# Altium schematic sheet Main_MCU_ATSAME54.SchDoc
size A4
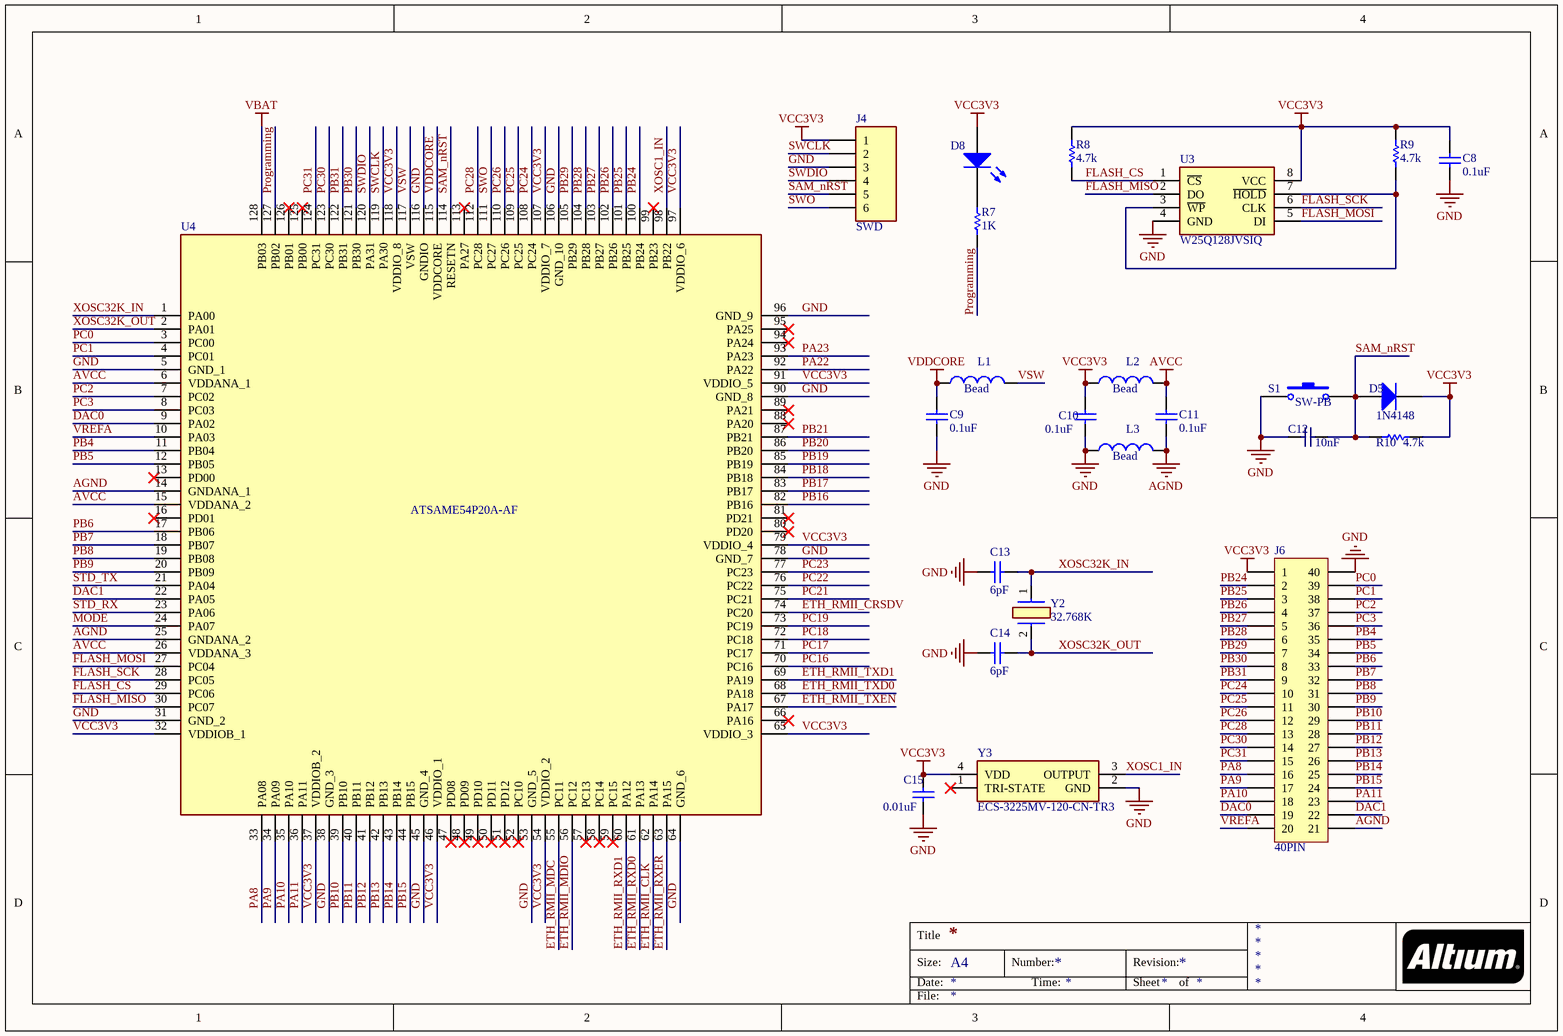
[diagram p0: Main_MCU_ATSAME54.SchDoc]

## Parts
C8  0.1uF  [SMD0603]
C9  0.1uF  [SMD0603]
C10  0.1uF  [SMD0603]
C11  0.1uF  [SMD0603]
C12  10nF  [SMD0603]
C13  6pF  [SMD0603]
C14  6pF  [SMD0603]
C15  0.01uF  [SMD0603]
D5  1N4148  [1N4148]
D8  LED0  [SMD0603_LED]  (value not drawn)
J4  SWD  [ISP]
J6  40PIN  [40PIN]
L1  Bead  [SMD0603]
L2  Bead  [SMD0603]
L3  Bead  [SMD0603]
R7  1K  [SMD0603]
R8  4.7k  [SMD0603]
R9  4.7k  [SMD0603]
R10  4.7K  [SMD0603]
S1  SW-PB  [Button]
U3  W25Q128JVSIQ  [SOIC127P790X216-8N]
U4  ATSAME54P20A-AF  [QFP40P1600X1600X120-128N]
Y2  32.768K  [ECS327634RTR]
Y3  ECS-3225MV-120-CN-TR3  [OSC3225]

## Nets
AGND: C11.2 J6.21 L3.2 U4.14(GNDANA_1) U4.25(GNDANA_2)
AVCC: C11.1 L2.2 U4.6(VDDANA_1) U4.15(VDDANA_2) U4.26(VDDANA_3)
GND: C8.2 C9.2 C10.2 C12.1 C13.2 C14.2 C15.1 J4.3 J6.40 L3.1 S1.1 U3.4(GND) U4.5(GND_1) U4.31(GND_2) U4.38(GND_3) U4.45(GND_4) U4.53(GND_5) U4.64(GND_6) U4.78(GND_7) U4.90(GND_8) U4.96(GND_9) U4.106(GND_10) U4.116(GNDIO) Y3.2(GND)
VBAT: U4.128(PB03)
VCC3V3: C8.1 C10.1 C15.2 D5.2 D8.1(A) J4.1 J6.1 L2.1 R8.2 R9.2 R10.2 U3.8(VCC) U4.32(VDDIOB_1) U4.37(VDDIOB_2) U4.46(VDDIO_1) U4.54(VDDIO_2) U4.65(VDDIO_3) U4.79(VDDIO_4) U4.91(VDDIO_5) U4.97(VDDIO_6) U4.107(VDDIO_7) U4.118(VDDIO_8) Y3.4(VDD)
VDDCORE: C9.1 L1.1 U4.115(VDDCORE)
DAC0: J6.19 U4.9(PA02)
DAC1: J6.22 U4.22(PA05)
ETH_RMII_CLK: U4.62(PA14)
ETH_RMII_CRSDV: U4.74(PC20)
ETH_RMII_MDC: U4.55(PC11)
ETH_RMII_MDIO: U4.56(PC12)
ETH_RMII_RXD0: U4.61(PA13)
ETH_RMII_RXD1: U4.60(PA12)
ETH_RMII_RXER: U4.63(PA15)
ETH_RMII_TXD0: U4.68(PA18)
ETH_RMII_TXD1: U4.69(PA19)
ETH_RMII_TXEN: U4.67(PA17)
FLASH_CS: R8.1 U3.1(~{CS}) U4.29(PC06)
FLASH_MISO: U3.2(DO) U4.30(PC07)
FLASH_MOSI: U3.5(DI) U4.27(PC04)
FLASH_SCK: U3.6(CLK) U4.28(PC05)
MODE: U4.24(PA07)
PA8: J6.16 U4.33(PA08)
PA9: J6.17 U4.34(PA09)
PA10: J6.18 U4.35(PA10)
PA11: J6.23 U4.36(PA11)
PA22: U4.92(PA22)
PA23: U4.93(PA23)
PB4: J6.35 U4.11(PB04)
PB5: J6.34 U4.12(PB05)
PB6: J6.33 U4.17(PB06)
PB7: J6.32 U4.18(PB07)
PB8: J6.31 U4.19(PB08)
PB9: J6.30 U4.20(PB09)
PB10: J6.29 U4.39(PB10)
PB11: J6.28 U4.40(PB11)
PB12: J6.27 U4.41(PB12)
PB13: J6.26 U4.42(PB13)
PB14: J6.25 U4.43(PB14)
PB15: J6.24 U4.44(PB15)
PB16: U4.82(PB16)
PB17: U4.83(PB17)
PB18: U4.84(PB18)
PB19: U4.85(PB19)
PB20: U4.86(PB20)
PB21: U4.87(PB21)
PB24: J6.2 U4.100(PB24)
PB25: J6.3 U4.101(PB25)
PB26: J6.4 U4.102(PB26)
PB27: J6.5 U4.103(PB27)
PB28: J6.6 U4.104(PB28)
PB29: J6.7 U4.105(PB29)
PB30: J6.8 U4.121(PB30)
PB31: J6.9 U4.122(PB31)
PC0: J6.39 U4.3(PC00)
PC1: J6.38 U4.4(PC01)
PC2: J6.37 U4.7(PC02)
PC3: J6.36 U4.8(PC03)
PC16: U4.70(PC16)
PC17: U4.71(PC17)
PC18: U4.72(PC18)
PC19: U4.73(PC19)
PC21: U4.75(PC21)
PC22: U4.76(PC22)
PC23: U4.77(PC23)
PC24: J6.10 U4.108(PC24)
PC25: J6.11 U4.109(PC25)
PC26: J6.12 U4.110(PC26)
PC28: J6.13 U4.112(PC28)
PC30: J6.14 U4.123(PC30)
PC31: J6.15 U4.124(PC31)
Programming: R7.1 U4.127(PB02)
SAM_nRST: C12.2 D5.1 J4.5 R10.1 S1.2 U4.114(RESETN)
STD_RX: U4.23(PA06)
STD_TX: U4.21(PA04)
SWCLK: J4.2 U4.119(PA30)
SWDIO: J4.4 U4.120(PA31)
SWO: J4.6 U4.111(PC27)
VREFA: J6.20 U4.10(PA03)
VSW: L1.2 U4.117(VSW)
XOSC1_IN: U4.98(PB22) Y3.3(OUTPUT)
XOSC32K_IN: C13.1 U4.1(PA00) Y2.1(OUT/IN)
XOSC32K_OUT: C14.1 U4.2(PA01) Y2.2(OUT/IN)
NetD8_2: D8.2(K) R7.2
NetR9_1: R9.1 U3.3(~{WP}) U3.7(~{HOLD})

Not connected (* = marked no-connect by the designer): U4 13(PD00)* 16(PD01)* 47(PD08)* 48(PD09)* 49(PD10)* 50(PD11)* 51(PD12)* 52(PC10)* 57(PC13)* 58(PC14)* 59(PC15)* 66(PA16)* 80(PD20)* 81(PD21)* 88(PA20)* 89(PA21)* 94(PA24)* 95(PA25)* 99(PB23)* 113(PA27)* 125(PB00)* 126(PB01)*; Y3 1(TRI-STATE)*

## Notes on the sheet
- Title
- Size:
- Date:
- A4
- Number:
- Time:
- Revision:
- Sheet
- of
- File:

## Library data of the parts
C8-C11 C13-C15 = Cap Semi: Capacitor (Semiconductor SIM Model); Published: 8-Jun-2000; LatestRevisionDate: 29-May-2009; LatestRevisionNote: IPC-7351 Footprint Added.; PackageReference: C1206; Publisher: Altium Limited; PackageDescription: Chip Capacitor
  C8-C11: Value: 0.1uF
  C13 C14: Value: 6pF
  C15: Value: 0.01uF
C12 = Cap: Capacitor (Semiconductor SIM Model); Value: 10nF
D5 = Diode 1N4148: Diode; Note: Pin 2 is not connected and not drawn.; Published: 21-Mar-2003; DatasheetDocument: Oct-1999; PackageDocument: Sep-2001; PackageReference: SOT-23; Publisher: Altium Limited; ComponentLink1Description: Manufacturer Link; ComponentLink1URL: http://www.infineon.com/
D8 = LED0: Typical INFRARED GaAs LED; Published: 8-Jun-2000; LatestRevisionDate: 08-Jul-2005; LatestRevisionNote: Mech Layer 1 removed.; PackageReference: LED-0; Publisher: Altium Limited; PackageDescription: LED; 2 Leads
J6 = 2x20_header
L1-L3 = Inductor: Code_IEC: 1005; Published: 8-Jun-2000; LatestRevisionDate: 29-May-2009; LatestRevisionNote: IPC-7351 Footprint Added.; PackageReference: 0402-A; Publisher: Altium Limited; PackageDescription: Chip Inductor; Code_JEITA: 0402; Value: Bead
R7 = Res Semi: Semiconductor Resistor; Published: 8-Jun-2000; LatestRevisionDate: 17-Jul-2002; LatestRevisionNote: Re-released for DXP Platform.; PackageReference: AXIAL-0.5; Publisher: Altium Limited; PackageDescription: Axial Device, Thru-Hole; 2 Leads; 0.5 in Pin Spacing; Value: 1K
R8-R10 = Res: Semiconductor Resistor; Value: 4.7k
S1 = SW-PB: Switch; Published: 24-Mar-1999; LatestRevisionDate: 17-Jul-2002; LatestRevisionNote: Re-released for DXP Platform.; PackageReference: SPST-2; Publisher: Altium Limited; PackageDescription: Switch; 2 Leads
U3 = W25Q128JVSIQ: Integrated Circuit; Manufacturer_Name: Winbond; Datasheet Link: https://componentsearchengine.com//W25Q128JVSIQ.pdf; Height: 2.16mm; Mouser2 Part Number: 454-W25Q128JVSIQ; Mouser2 Price/Stock: https://www.mouser.com/Search/Refine.aspx?Keyword=454-W25Q128JVSIQ; Manufacturer_Part_Number: W25Q128JVSIQ
U4 = ATSAME54P20A-AF: Integrated Circuit; Manufacturer_Name: Microchip; Datasheet Link: https://componentsearchengine.com//ATSAME54P20A-AF.pdf; Height: 1.2mm; Mouser2 Part Number: 556-ATSAME54P20A-AF; Mouser2 Price/Stock: https://www.mouser.com/Search/Refine.aspx?Keyword=556-ATSAME54P20A-AF; Manufacturer_Part_Number: ATSAME54P20A-AF
Y2 = ECS-.327-6-34R-TR: Crystal or Oscillator; Manufacturer_Name: ECS; Datasheet Link: https://ecsxtal.com/store/pdf/ECX_34R.pdf; Height: 0.9mm; Manufacturer_Part_Number: ECS-.327-6-34R-TR
Y3 = ECS-3225MV-120-CN-TR3: Crystal or Oscillator; Manufacturer_Name: ECS; Datasheet Link: https://ecsxtal.com/store/pdf/ECS-3225MV.pdf; Height: 1.2mm; Manufacturer_Part_Number: ECS-3225MV-120-CN-TR3